# EAGLE design ArmLeap (EAGLE 7.2.0)
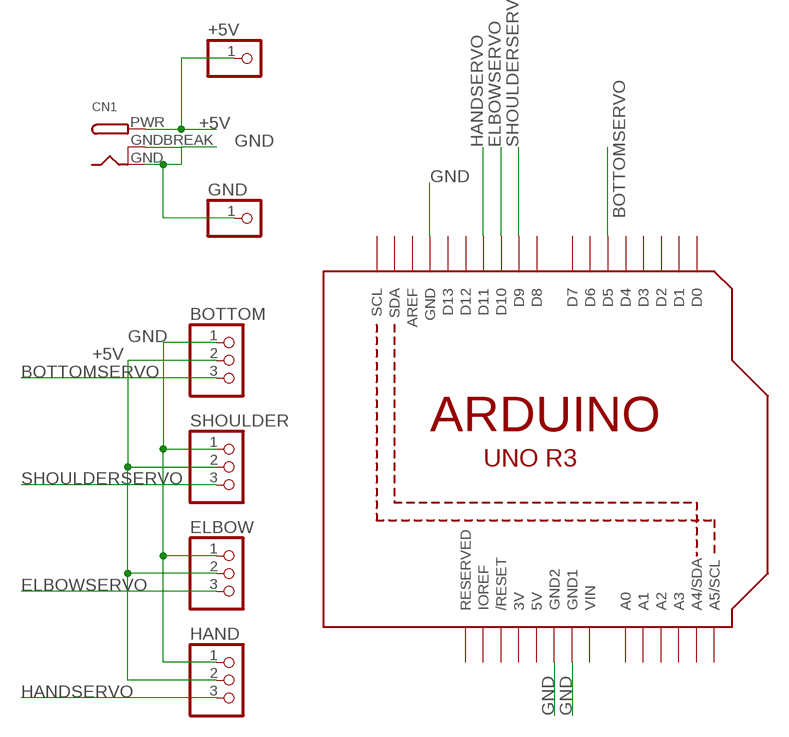
[diagram p0: schematic, sheet 1]

## Parts
+5V  PINHD-1X1  [1X01]
BOTTOM  PINHD-1X3  [1X03]
CN1  DCBARRELPTH  [DCJACK_2MM_PTH]
ELBOW  PINHD-1X3  [1X03]
GND  PINHD-1X1  [1X01]
HAND  PINHD-1X3  [1X03]
SHOULDER  PINHD-1X3  [1X03]
U1  ARDUINOR3-DIMENSION  [ARDUINOR3]

## Nets
+5V: +5V.1 BOTTOM.2 CN1.PWR ELBOW.2 HAND.2 SHOULDER.2
BOTTOMSERVO: BOTTOM.3 U1.D5
ELBOWSERVO: ELBOW.3 U1.D10
GND: BOTTOM.1 CN1.GND CN1.GNDBREAK ELBOW.1 GND.1 HAND.1 SHOULDER.1 U1.GND U1.GND1 U1.GND2
HANDSERVO: HAND.3 U1.D11
SHOULDERSERVO: SHOULDER.3 U1.D9
Unconnected: U1.A0 U1.A1 U1.A2 U1.A3 U1.A4(A4/SDA) U1.A5(A5/SCL) U1.AREF U1.D0 U1.D1 U1.D2 U1.D3 U1.D4 U1.D6 U1.D7 U1.D8 U1.D12 U1.D13 U1.IOREF U1.RESERVED U1.RESET(/RESET) U1.SCL U1.SDA

## Power pins joined to a net without a drawn wire
3V: U1.3V
5V: U1.5V
VIN: U1.VIN

## Library data of the parts
+5V GND = adafruit:PINHD-1X1: Pin header 1x1 for 0.1" spacing With round pins
BOTTOM ELBOW HAND SHOULDER = adafruit:PINHD-1X3: PIN HEADER
CN1 = adafruit:DCBARREL: 2.0mm DC Barrel Jack DCJACK_2MM_PTH - Through Hole Jack (4UConnector: 05537)
U1 = adafruit:ARDUINOR3: This is a new object for the new Arduino R3 - with extra pins that you may want to use (such as IOref, and duplicated A4/A5

## Board
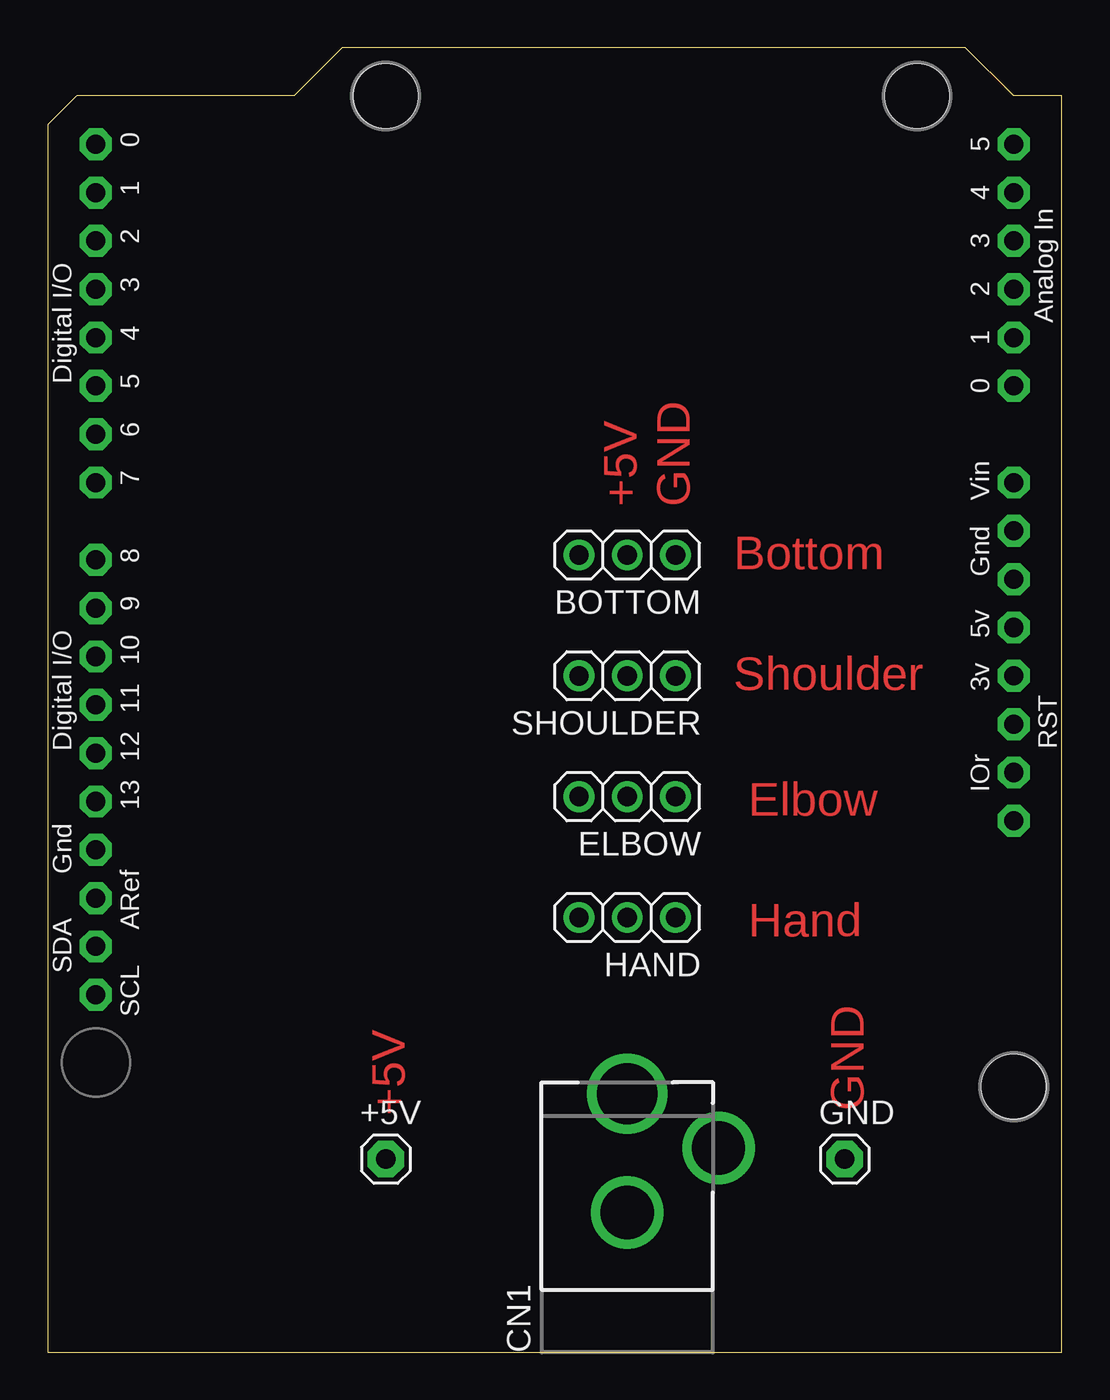
[diagram p1: board, top side]
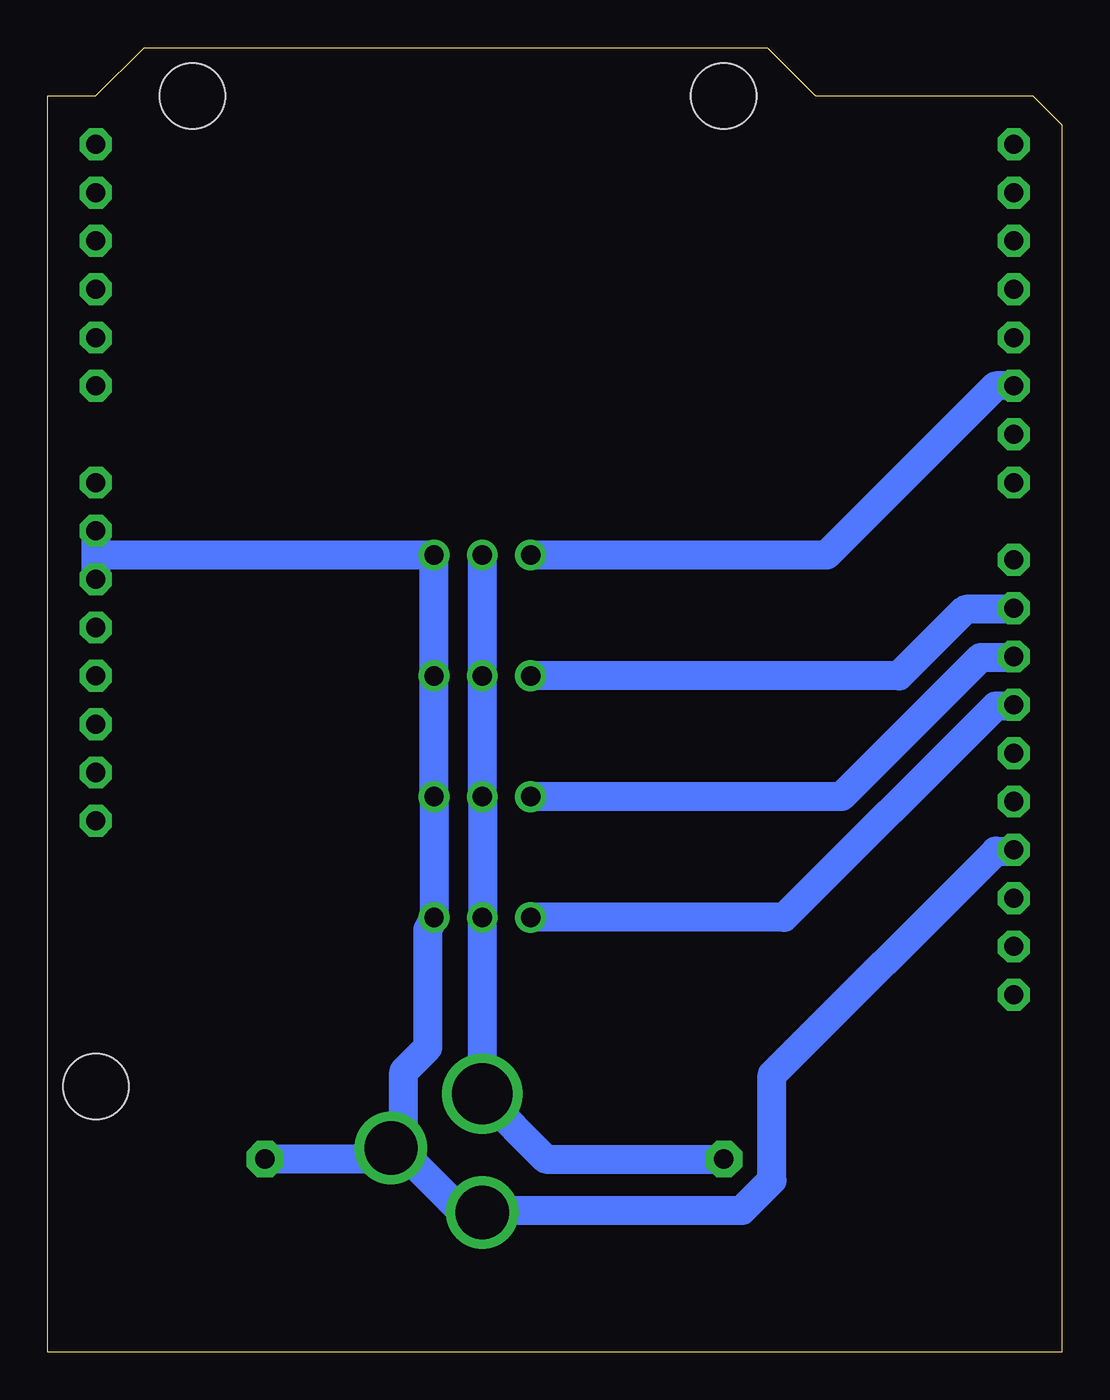
[diagram p2: board, bottom side, seen from below]

Size 53.34 x 68.58 mm. Coordinates in mm from the lower left corner, seen from the top.
Copper layers (1*16): Top 0.035mm / dielectric 1.5mm / Bottom 0.035mm
Design rules "SparkFun *": minimum track width 60mil, minimum drill 20mil, track to track 30mil, track to pad 30mil, pad to pad 8mil, via to via 8mil, smd to smd 8mil, copper to edge 10mil, drill to drill 8mil, minimum pad ring 12mil, minimum via ring 10mil, stop-mask expansion 4mil, vias tented up to drill 25mil, thermal gap 10mil
Holes 3.45 mm at 17.78,66.04 45.72,66.04 50.8,13.97

### Footprints (pad centres in the part's own frame; a part is rotated, then mirrored left to right if it is on the bottom)
1X01 = drill 1.016 pad 1.93 octagon: 1 0,0
1X03 = drill 1.016: 1 -2.54,0; 2 0,0; 3 2.54,0
DCJACK_2MM_PTH = drill 2.8: GND 0,7.35; GNDBREAK 4.8,10.75 | drill 3.2: PWR 0,13.6
ARDUINOR3 = drill 1 pad 1.676 octagon: 3V 35.56,2.54; 5V 38.1,2.54; A0 50.8,2.54; A1 53.34,2.54; A2 55.88,2.54; A3 58.42,2.54; A4 60.96,2.54; A5 63.5,2.54; AREF 23.876,50.8; D0 63.5,50.8; D1 60.96,50.8; D2 58.42,50.8; D3 55.88,50.8; D4 53.34,50.8; D5 50.8,50.8; D6 48.26,50.8; D7 45.72,50.8; D8 41.656,50.8; D9 39.116,50.8; D10 36.576,50.8; D11 34.036,50.8; D12 31.496,50.8; D13 28.956,50.8; GND 26.416,50.8; GND1 43.18,2.54; GND2 40.64,2.54; IOREF 30.48,2.54; RESERVED 27.94,2.54; RESET 33.02,2.54; SCL 18.796,50.8; SDA 21.336,50.8; VIN 45.72,2.54

### Placement (x,y rotation side)
+5V  17.78,10.16 0 top
BOTTOM  30.48,41.91 180 top
CN1  30.48,0 0 top
ELBOW  30.48,29.21 180 top
GND  41.91,10.16 0 top
HAND  30.48,22.86 180 top
SHOULDER  30.48,35.56 180 top
U1  53.34,0 90 top

### Tracks (layer width: path | path; a pad name or v marks a point on that pad's centre or on a via)
+5V
  Bottom 1.524: BOTTOM.2 SHOULDER.2 ELBOW.2 HAND.2 CN1.PWR 30.48,13.49 27.15,10.16 +5V.1
BOTTOMSERVO
  Bottom 1.524: BOTTOM.3 12.38,41.91 3.49,50.8 U1.D5
ELBOWSERVO
  Bottom 1.524: ELBOW.3 11.59,29.21 4.29,36.51 2.54,36.51 U1.D10
GND
  Bottom 1.524: U1.GND1 50.8,41.91 | 50.8,41.91 U1.GND2 | 50.8,41.91 BOTTOM.1 SHOULDER.1 ELBOW.1 HAND.1 33.34,22.23 33.34,16.03 34.61,14.76 34.61,11.27 CN1.GNDBREAK | GND.1 35.88,10.16 35.4,10.64 CN1.GNDBREAK | U1.GND 2.54,26.35 3.49,26.35 15.24,14.61 15.24,9.05 16.83,7.46 30.48,7.46 CN1.GND 31.11,6.99 34.61,10.48 CN1.GNDBREAK
HANDSERVO
  Bottom 1.524: HAND.3 14.61,22.86 3.49,33.97 2.54,33.97 U1.D11
SHOULDERSERVO
  Bottom 1.524: SHOULDER.3 8.57,35.56 5.08,39.05 2.54,39.05 U1.D9

### Text on the board
Top: +5V | GND | Bottom | Shoulder | Elbow | Hand | GND | +5V